# EAGLE design flex_cable (EAGLE 9.5.1)
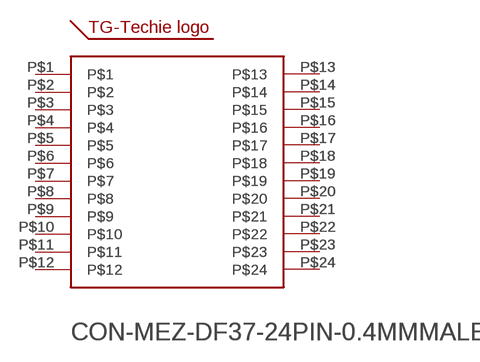
[diagram p0: schematic, sheet 1]

## Parts
U$1  CON-MEZ-DF37-24PIN-0.4MMMALE  [MEZ-DF37B-24DP]
U$2  LOGO-TG-TECHIE5MM  [TG-LOGO-5MM]
U$11  CON-MEZ-DF37-24PIN-0.4MMMALE  [MEZ-DF37B-24DP]

## Nets
N$1: U$1.P$1 U$11.P$1
N$2: U$1.P$2 U$11.P$2
N$3: U$1.P$3 U$11.P$3
N$4: U$1.P$4 U$11.P$4
N$5: U$1.P$5 U$11.P$5
N$6: U$1.P$6 U$11.P$6
N$7: U$1.P$7 U$11.P$7
N$8: U$1.P$8 U$11.P$8
N$9: U$1.P$9 U$11.P$9
N$10: U$1.P$10 U$11.P$10
N$11: U$1.P$11 U$11.P$11
N$12: U$1.P$12 U$11.P$12
N$13: U$1.P$13 U$11.P$13
N$14: U$1.P$14 U$11.P$14
N$15: U$1.P$15 U$11.P$15
N$16: U$1.P$16 U$11.P$16
N$17: U$1.P$17 U$11.P$17
N$18: U$1.P$18 U$11.P$18
N$19: U$1.P$19 U$11.P$19
N$20: U$1.P$20 U$11.P$20
N$21: U$1.P$21 U$11.P$21
N$22: U$1.P$22 U$11.P$22
N$23: U$1.P$23 U$11.P$23
N$24: U$1.P$24 U$11.P$24

## Library data of the parts
U$1 U$11 = 0TG-Lib v01.4:CON-MEZ-DF37-24PIN-0.4MM: digikey parts: ‎DF37NB-24DS-0.4V, ‎DF37B-24DP-0.4V https://www.digikey.com/product-detail/en/DF37NB-24DS-0.4V(51)/H11850CT-ND/2230650/?itemSeq=306482090 https://www.digikey.com/product-detail/en/DF37B-24DP-0.4V(53)/H11835CT-ND/2230636/?itemSeq=306823575
U$2 = 0TG-Lib v01.5:LOGO-TG-TECHIE

## Net classes
1 power: width 0.254 mm

## Board
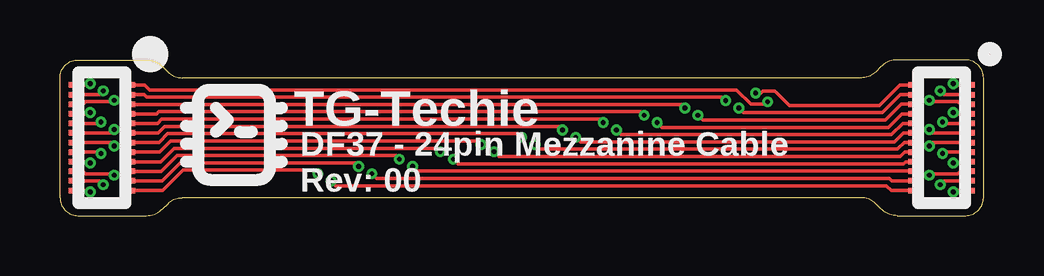
[diagram p1: board, top side]
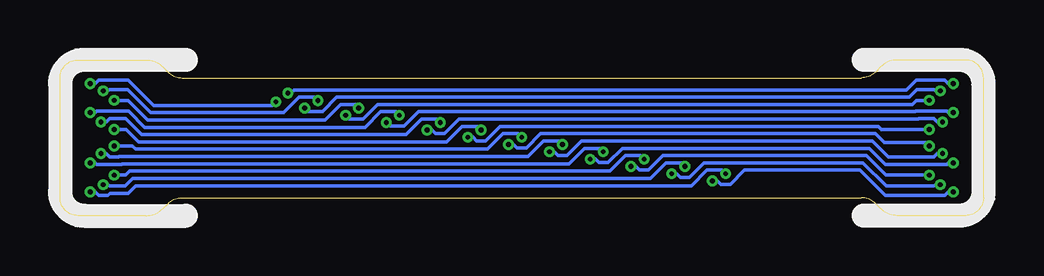
[diagram p2: board, bottom side, seen from below]

Size 38.5 x 6.5 mm. Coordinates in mm from the lower left corner, seen from the top.
Outline: 37.75,6.5 34.91,6.5 arc45 34.21,6.21 34,6 arc-45 33.4,5.75 5.1,5.75 arc-45 4.5,6 4.29,6.21 arc45 3.59,6.5 0.75,6.5 arc90 0,5.75 0,0.75 arc90 0.75,0 3.59,0 arc45 4.29,0.29 4.5,0.5 arc-45 5.1,0.75 33.4,0.75 arc-45 34,0.5 34.21,0.29 arc45 34.91,0 37.75,0 arc90 38.5,0.75 38.5,5.75 arc90 37.75,6.5
Copper layers (1*16): Top 0.035mm / dielectric 0.53mm / Bottom 0.035mm
Design rules "default *": minimum track width 6mil, minimum drill 0.2mm, track to track 6mil, track to pad 6mil, pad to pad 6mil, via to via 6mil, smd to smd 6mil, copper to edge 40mil, drill to drill 6mil, minimum pad ring 10mil, minimum via ring 0.125mm, stop-mask expansion 4mil, vias tented up to drill 10000mil, thermal gap 10mil

### Footprints (pad centres in the part's own frame; a part is rotated, then mirrored left to right if it is on the bottom)
MEZ-DF37B-24DP = smd 0.23 x 0.51: P$1 -2.2,1.14; P$2 -1.8,1.14; P$3 -1.4,1.14; P$4 -1,1.14; P$5 -0.6,1.14; P$6 -0.2,1.14; P$7 0.2,1.14; P$8 0.6,1.14; P$9 1,1.14; P$10 1.4,1.14; P$11 1.8,1.14; P$12 2.2,1.14; P$13 2.2,-1.14; P$14 1.8,-1.14; P$15 1.4,-1.14; P$16 1,-1.14; P$17 0.6,-1.14; P$18 0.2,-1.14; P$19 -0.2,-1.14; P$20 -0.6,-1.14; P$21 -1,-1.14; P$22 -1.4,-1.14; P$23 -1.8,-1.14; P$24 -2.2,-1.14

### Placement (x,y rotation side)
U$1  36.75,3.25 270 top
U$2  7.25,3.25 0 top
U$11  1.75,3.25 270 top

### Tracks (layer width: path | path; a pad name or v marks a point on that pad's centre or on a via)
N$1  (via drill 0.2)
  Top 0.152: U$1.P$1 37.31,5.45 v37.24,5.52 | v29.5,4.75 29.41,4.66 28.8,4.66 28.2,5.25 3.74,5.25 3.54,5.45 U$11.P$1
  Bottom 0.152: v37.24,5.52 37.03,5.52 36.88,5.66 35.65,5.66 34.59,4.6 29.65,4.6 v29.5,4.75
N$2  (via drill 0.2)
  Top 0.152: U$1.P$2 37.57,5.05 37.56,5.06 36.84,5.06 v36.7,5.21 | v27.75,4.8 27.6,4.95 3.61,4.95 3.51,5.05 U$11.P$2
  Bottom 0.152: v36.7,5.21 36.48,5.21 36.43,5.27 35.69,5.27 34.72,4.3 29.17,4.3 28.52,4.95 27.9,4.95 v27.75,4.8
N$3  (via drill 0.2)
  Top 0.152: U$1.P$3 37.54,4.65 37.43,4.76 36.3,4.76 v36.24,4.81 | v26.05,4.49 25.9,4.64 U$11.P$3
  Bottom 0.152: v36.24,4.81 35.66,4.81 34.84,3.99 27.45,3.99 26.8,4.64 26.2,4.64 v26.05,4.49
N$4  (via drill 0.2)
  Top 0.152: U$1.P$4 37.3,4.25 v37.24,4.3 | v24.35,4.19 24.2,4.34 4.12,4.34 4.03,4.25 U$11.P$4
  Bottom 0.152: v24.35,4.19 24.5,4.34 25.13,4.34 25.78,3.69 34.97,3.69 35.64,4.36 36.98,4.36 37.03,4.3 v37.24,4.3
N$5  (via drill 0.2)
  Top 0.152: U$1.P$5 36.84,3.85 v36.79,3.9 | v22.65,3.88 22.5,4.03 4.25,4.03 4.06,3.85 U$11.P$5
  Bottom 0.152: v22.65,3.88 22.8,4.03 23.43,4.03 24.08,3.38 35.09,3.38 35.77,4.05 36.43,4.05 36.58,3.9 v36.79,3.9
N$6  (via drill 0.2)
  Top 0.152: U$1.P$6 36.39,3.45 v36.24,3.6 | v20.95,3.58 20.8,3.73 4.37,3.73 4.09,3.45 U$11.P$6
  Bottom 0.152: v20.95,3.58 21.1,3.73 21.73,3.73 22.38,3.08 35.22,3.08 35.74,3.6 v36.24,3.6
N$7  (via drill 0.2)
  Top 0.152: U$1.P$7 36.39,3.05 v36.24,2.9 | v19.25,3.27 19.1,3.42 4.5,3.42 4.13,3.05 U$11.P$7
  Bottom 0.152: v19.25,3.27 19.4,3.42 20.03,3.42 20.68,2.77 35.35,2.77 35.49,2.91 36.23,2.91 v36.24,2.9
N$8  (via drill 0.2)
  Top 0.152: U$1.P$8 36.84,2.65 v36.79,2.6 | v17.55,2.97 17.4,3.12 4.62,3.12 4.16,2.65 U$11.P$8
  Bottom 0.152: v36.79,2.6 36.58,2.6 36.43,2.45 36.05,2.45 36.03,2.47 18.98,2.47 18.33,3.12 17.7,3.12 v17.55,2.97
N$9  (via drill 0.2)
  Top 0.152: U$1.P$9 37.84,2.2 v37.24,2.2 | v15.85,2.66 15.7,2.81 4.75,2.81 4.19,2.25 U$11.P$9
  Bottom 0.152: v37.24,2.2 37.03,2.2 36.98,2.14 35.93,2.14 35.91,2.16 17.28,2.16 16.63,2.81 16,2.81 v15.85,2.66
N$10  (via drill 0.2)
  Top 0.152: U$1.P$10 37.54,1.85 37.43,1.74 36.3,1.74 v36.24,1.69 | v14.15,2.36 14,2.51 4.88,2.51 4.22,1.85 U$11.P$10
  Bottom 0.152: v14.15,2.36 14.3,2.51 14.93,2.51 15.58,1.86 35.59,1.86 35.76,1.69 v36.24,1.69
N$11  (via drill 0.2)
  Top 0.152: U$1.P$11 37.57,1.45 37.56,1.44 36.84,1.44 v36.7,1.29 | v12.45,2.05 12.3,2.2 5,2.2 4.25,1.45 U$11.P$11
  Bottom 0.152: v36.7,1.29 36.48,1.29 36.43,1.23 35.78,1.23 35.47,1.55 13.88,1.55 13.23,2.2 12.6,2.2 v12.45,2.05
N$12  (via drill 0.2)
  Top 0.152: U$1.P$12 37.31,1.05 v37.24,0.98 | v10.75,1.75 10.6,1.9 5.13,1.9 4.28,1.05 U$11.P$12
  Bottom 0.152: v37.24,0.98 37.03,0.98 36.88,0.84 36.51,0.84 36.41,0.93 35.66,0.93 35.34,1.25 12.18,1.25 11.53,1.9 10.9,1.9 v10.75,1.75
N$13  (via drill 0.2)
  Top 0.152: U$11.P$13 1.19,1.05 v1.26,0.98 | v11.3,1.44 11.49,1.25 34.45,1.25 34.65,1.05 U$1.P$13
  Bottom 0.152: v1.26,0.98 1.47,0.98 1.62,0.84 4.09,0.84 5.15,1.9 9.96,1.9 10.56,1.29 10.94,1.29 11.09,1.44 v11.3,1.44
N$14  (via drill 0.2)
  Top 0.152: U$11.P$14 0.93,1.45 0.94,1.44 1.66,1.44 v1.8,1.29 | v13,1.75 13.19,1.55 34.58,1.55 34.68,1.45 U$1.P$14
  Bottom 0.152: v1.8,1.29 2.02,1.29 2.07,1.23 4.05,1.23 5.02,2.2 11.66,2.2 12.26,1.6 12.64,1.6 12.79,1.75 v13,1.75
N$15  (via drill 0.2)
  Top 0.152: U$11.P$15 0.96,1.85 1.07,1.74 2.2,1.74 v2.26,1.69 | v14.7,2.05 14.89,1.86 U$1.P$15
  Bottom 0.152: v14.7,2.05 14.49,2.05 14.34,1.9 13.96,1.9 13.36,2.51 4.89,2.51 4.08,1.69 v2.26,1.69
N$16  (via drill 0.2)
  Top 0.152: U$11.P$16 1.2,2.25 v1.26,2.2 | v16.4,2.36 16.59,2.16 35.16,2.16 35.25,2.25 U$1.P$16
  Bottom 0.152: v1.26,2.2 1.47,2.2 1.52,2.14 4.1,2.14 4.77,2.81 15.06,2.81 15.66,2.21 16.04,2.21 16.19,2.36 v16.4,2.36
N$17  (via drill 0.2)
  Top 0.152: U$11.P$17 1.66,2.65 v1.71,2.6 | v18.1,2.66 18.29,2.47 35.04,2.47 35.22,2.65 U$1.P$17
  Bottom 0.152: v1.71,2.6 1.92,2.6 2.07,2.45 3.97,2.45 4.64,3.12 16.76,3.12 17.36,2.51 17.74,2.51 17.89,2.66 v18.1,2.66
N$18  (via drill 0.2)
  Top 0.152: U$11.P$18 2.11,3.05 v2.26,2.9 | v19.8,2.97 19.99,2.77 34.91,2.77 35.19,3.05 U$1.P$18
  Bottom 0.152: v19.8,2.97 19.59,2.97 19.44,2.82 19.06,2.82 18.46,3.42 4.52,3.42 4.14,3.05 2.41,3.05 v2.26,2.9
N$19  (via drill 0.2)
  Top 0.152: U$11.P$19 2.11,3.45 v2.26,3.6 | v21.5,3.27 21.69,3.08 34.78,3.08 35.16,3.45 U$1.P$19
  Bottom 0.152: v21.5,3.27 21.29,3.27 21.14,3.12 20.76,3.12 20.16,3.73 4.39,3.73 4.26,3.6 v2.26,3.6
N$20  (via drill 0.2)
  Top 0.152: U$11.P$20 1.66,3.85 v1.71,3.9 | v23.2,3.58 23.39,3.38 34.66,3.38 35.13,3.85 U$1.P$20
  Bottom 0.152: v1.71,3.9 1.92,3.9 2.07,4.05 2.7,4.05 2.72,4.03 21.86,4.03 22.46,3.43 22.84,3.43 22.99,3.58 v23.2,3.58
N$21  (via drill 0.2)
  Top 0.152: U$11.P$21 1.2,4.25 v1.26,4.3 | v24.9,3.88 25.09,3.69 34.53,3.69 35.09,4.25 U$1.P$21
  Bottom 0.152: v1.26,4.3 1.47,4.3 1.52,4.36 2.82,4.36 2.85,4.34 23.56,4.34 24.16,3.73 24.75,3.73 v24.9,3.88
N$22  (via drill 0.2)
  Top 0.152: U$11.P$22 0.96,4.65 1.07,4.76 2.2,4.76 v2.26,4.81 | v26.6,4.19 26.79,3.99 34.41,3.99 35.06,4.65 U$1.P$22
  Bottom 0.152: v26.6,4.19 26.45,4.04 25.86,4.04 25.26,4.64 2.97,4.64 2.8,4.81 v2.26,4.81
N$23  (via drill 0.2)
  Top 0.152: U$11.P$23 0.93,5.05 0.94,5.06 1.66,5.06 v1.8,5.21 | v28.3,4.49 28.49,4.3 34.28,4.3 35.03,5.05 U$1.P$23
  Bottom 0.152: v1.8,5.21 2.02,5.21 2.07,5.27 2.78,5.27 3.1,4.95 26.96,4.95 27.56,4.34 28.15,4.34 v28.3,4.49
N$24  (via drill 0.2)
  Top 0.152: U$11.P$24 1.19,5.45 v1.26,5.52 | v29,5.11 29.22,5.11 29.31,5.2 29.8,5.2 30.4,4.6 34.15,4.6 35,5.45 U$1.P$24
  Bottom 0.152: v29,5.11 28.89,5.11 28.75,5.25 3.23,5.25 2.81,5.66 1.62,5.66 1.47,5.52 v1.26,5.52

### Text on the board
tPlace: DF37 - 24pin Mezzanine Cable / Rev: 00